# EAGLE design NSE2020_1 (EAGLE 9.4.2)
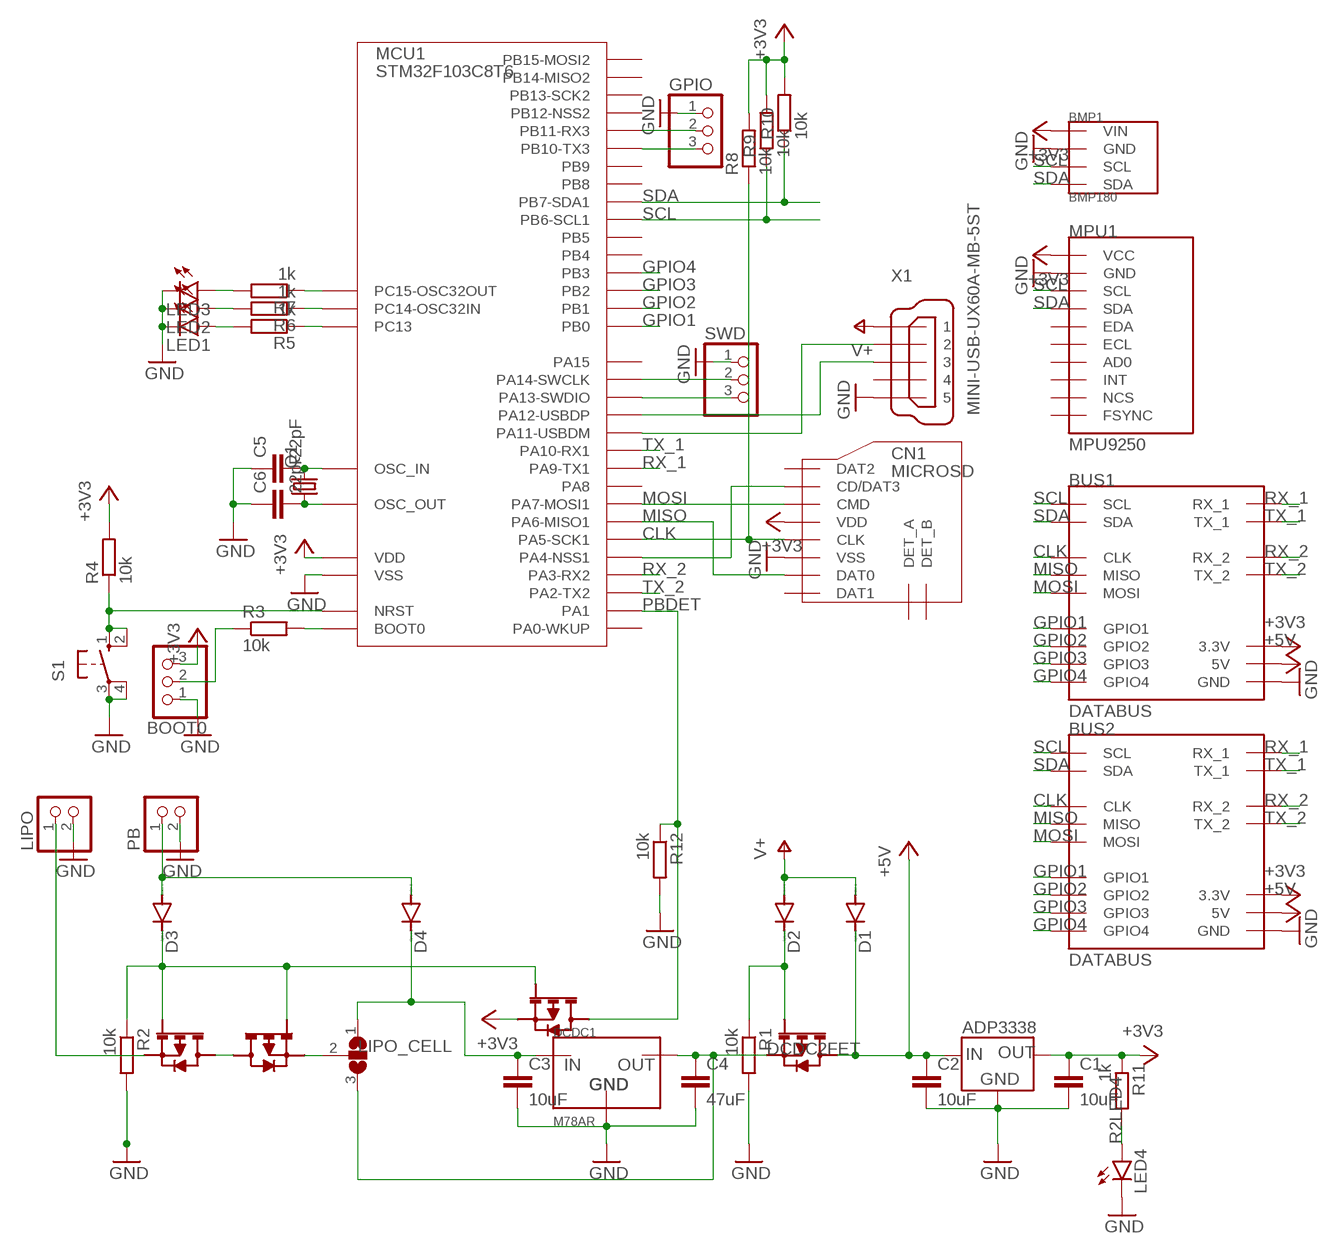
[diagram p0: schematic, sheet 1]

## Parts
BMP1  BMP180  [GY-68]
BOOT0  PINHD-1X3  [1X03]
BUS1  DATABUS  [8X2]
BUS2  DATABUS  [8X2]
C1  10uF  C-EUC2012  [C2012]
C2  10uF  C-EUC2012  [C2012]
C3  10uF  C-EUC2012  [C2012]
C4  47uF  C-EUC2012  [C2012]
C5  22pF  C-EUC2012  [C2012]
C6  22pF  C-EUC2012  [C2012]
CN1  MICROSD  [DM3AT]
D1  DIODE-SOD123  [SOD123]
D2  DIODE-SOD123  [SOD123]
D3  DIODE-SOD123  [SOD123]
D4  DIODE-SOD123  [SOD123]
DCDC1  M78AR  [M78AR]
GPIO  PINHD-1X3  [1X03]
IC1  ADP3338-3.3  [SOT-223]
LED1  LEDSMT1206  [1206]
LED2  LEDSMT1206  [1206]
LED3  LEDSMT1206  [1206]
LED4  LEDSMT1206  [1206]
LIPO  PINHD-1X2  [1X02]
LIPO_CELL  SJ2W  [SJ_2]
MCU1  STM32F103C8T6  [LQFP48]
MPU1  MPU9250  [GY-9250]
PB  PINHD-1X2  [1X02]
Q1  CRYSTALHC49S  [HC49/S]
R1  10k  R-EU_M2012  [M2012]
R2  10k  R-EU_M2012  [M2012]
R3  10k  R-EU_M2012  [M2012]
R4  10k  R-EU_M2012  [M2012]
R5  1k  R-EU_M2012  [M2012]
R6  1k  R-EU_M2012  [M2012]
R7  1k  R-EU_M2012  [M2012]
R8  10k  R-EU_M2012  [M2012]
R9  10k  R-EU_M2012  [M2012]
R10  10k  R-EU_M2012  [M2012]
R11  1k  R-EU_M2012  [M2012]
R12  10k  R-EU_M2012  [M2012]
S1  10-XX  [B3F-10XX]
SWD  PINHD-1X3  [1X03]
U$1  2SJ681  [2SJ681]
U$2  2SJ681  [2SJ681]
U$3  2SJ681  [2SJ681]
U$4  2SJ681  [2SJ681]
X1  MINI-USB-UX60A-MB-5ST  [UX60A-MB-5ST]

## Nets
+3V3 [PWR_L]: BMP1.P1(VIN) BOOT0.3 BUS1.P6(3.3V) BUS2.P6(3.3V) C1.1 CN1.VDD IC1.1(OUT) IC1.2(OUT) MCU1.1(VDD) MCU1.9(VDD) MCU1.24(VDD) MCU1.36(VDD) MCU1.48(VDD) MPU1.P1(VCC) R4.2 R8.2 R9.2 R10.2 R11.1 U$4.P$3
+5V [PWR_H]: BUS1.P7(5V) BUS2.P7(5V) C2.1 D1.C IC1.3(IN) U$1.P$2 U$1.P$4
BAT2DCDC [PWR_H]: C3.1 D4.C DCDC1.P1(IN) LIPO_CELL.1
BOOT0 [SIGNAL]: BOOT0.2 R3.1
BOOT0_R [SIGNAL]: MCU1.44(BOOT0) R3.2
CLK [SIGNAL]: BUS1.P1(CLK) BUS2.P1(CLK) CN1.CLK MCU1.15(PA5-SCK1) R8.1
CRYIN [IO]: C5.2 MCU1.5(OSC_IN) Q1.2
CRYOUT [IO]: C6.2 MCU1.6(OSC_OUT) Q1.1
CS_SD [SIGNAL]: CN1.CD/DAT3 MCU1.14(PA4-NSS1)
DCDC2FET [PWR_H]: C4.1 DCDC1.P3(OUT) LIPO_CELL.3 U$1.P$3
DM [SIGNAL]: MCU1.32(PA11-USBDM) X1.2
DP [SIGNAL]: MCU1.33(PA12-USBDP) X1.3
FET2JUMP [PWR_H]: LIPO_CELL.2 U$2.P$3
GND [GND]: BMP1.P2(GND) BOOT0.1 BUS1.P11(GND) BUS2.P11(GND) C1.2 C2.2 C3.2 C4.2 C5.1 C6.1 CN1.VSS DCDC1.P2(GND) GPIO.1 IC1.4(GND) LED1.C LED2.C LED3.C LED4.C LIPO.2 MCU1.8(VSS) MCU1.23(VSS) MCU1.35(VSS) MCU1.47(VSS) MPU1.P10(GND) PB.2 R1.2 R2.2 R12.2 S1.3(P) S1.4(P1) SWD.1 X1.5
GPIO1 [SIGNAL]: BUS1.P3(GPIO1) BUS2.P3(GPIO1) MCU1.18(PB0)
GPIO2 [SIGNAL]: BUS1.P10(GPIO2) BUS2.P10(GPIO2) MCU1.19(PB1)
GPIO3 [SIGNAL]: BUS1.P14(GPIO3) BUS2.P14(GPIO3) MCU1.20(PB2)
GPIO4 [SIGNAL]: BUS1.P15(GPIO4) BUS2.P15(GPIO4) MCU1.39(PB3)
IO2LED1 [IO]: MCU1.2(PC13) R5.1
IO2R2 [IO]: MCU1.3(PC14-OSC32IN) R6.1
IO2R3 [IO]: MCU1.4(PC15-OSC32OUT) R7.1
LIPO_FET2FET [PWR_H]: U$2.P$2 U$2.P$4 U$3.P$2 U$3.P$4
LIPOIN [PWR_H]: LIPO.1 U$3.P$3
MISO [SIGNAL]: BUS1.P12(MISO) BUS2.P12(MISO) CN1.DAT0 MCU1.16(PA6-MISO1)
MOSI [SIGNAL]: BUS1.P2(MOSI) BUS2.P2(MOSI) CN1.CMD MCU1.17(PA7-MOSI1)
NRST [SIGNAL]: MCU1.7(NRST) R4.1 S1.1(S) S1.2(S1)
PBDET [SIGNAL]: MCU1.11(PA1) R12.1 U$4.P$2 U$4.P$4
PBGATE [SIGNAL]: D3.C R2.1 U$2.P$1 U$3.P$1 U$4.P$1
PBIN [PWR_H]: D3.A D4.A PB.1
R2LED1 [IO]: LED1.A R5.2
R2LED2 [IO]: LED2.A R6.2
R2LED3 [IO]: LED3.A R7.2
R2LED4 [PWR_L]: LED4.A R11.2
RX_1 [SIGNAL]: BUS1.P4(RX_1) BUS2.P4(RX_1) MCU1.30(PA9-TX1)
RX_2 [SIGNAL]: BUS1.P9(RX_2) BUS2.P9(RX_2) MCU1.13(PA3-RX2)
RX_3 [IO]: GPIO.2 MCU1.22(PB11-RX3)
SCL [SIGNAL]: BMP1.P3(SCL) BUS1.P0(SCL) BUS2.P0(SCL) MCU1.42(PB6-SCL1) MPU1.P3(SCL) R9.1
SDA [SIGNAL]: BMP1.P4(SDA) BUS1.P13(SDA) BUS2.P13(SDA) MCU1.43(PB7-SDA1) MPU1.P4(SDA) R10.1
SWCLK [SIGNAL]: MCU1.37(PA14-SWCLK) SWD.2
SWDIO [SIGNAL]: MCU1.34(PA13-SWDIO) SWD.3
TX_1 [SIGNAL]: BUS1.P5(TX_1) BUS2.P5(TX_1) MCU1.31(PA10-RX1)
TX_2 [SIGNAL]: BUS1.P8(TX_2) BUS2.P8(TX_2) MCU1.12(PA2-TX2)
TX_3 [IO]: GPIO.3 MCU1.21(PB10-TX3)
USBGATE [SIGNAL]: D2.C R1.1 U$1.P$1
V+ [PWR_H]: D1.A D2.A X1.1
Unconnected: CN1.DAT1 CN1.DAT2 CN1.DET_A CN1.DET_B MCU1.10(PA0-WKUP) MCU1.25(PB12-NSS2) MCU1.26(PB13-SCK2) MCU1.27(PB14-MISO2) MCU1.28(PB15-MOSI2) MCU1.29(PA8) MCU1.38(PA15) MCU1.40(PB4) MCU1.41(PB5) MCU1.45(PB8) MCU1.46(PB9) MPU1.P2(AD0) MPU1.P5(ECL) MPU1.P6(EDA) MPU1.P7(FSYNC) MPU1.P8(INT) MPU1.P9(NCS) X1.4

## Library data of the parts
BMP1 = BMP180:BMP180
BOOT0 GPIO SWD = pinhead:PINHD-1X3: PIN HEADER
BUS1 BUS2 = databus:DATABUS
C1-C6 = rcl:C-EU: CAPACITOR, European symbol; SPICEPREFIX: C
CN1 = microSD:MICROSD
D1-D4 = diode:DIODE-: DIODE
DCDC1 = M78AR:M78AR
IC1 = ADP3338:ADP3338-3.3
LED1-LED4 = led:LED: LED OSRAM: - CHIPLED LG R971, LG N971, LY N971, LG Q971, LY Q971, LO R971, LY R971 LH N974, LH R974 LS Q976, LO Q976, LY Q976 LO Q996 - Hyper CHIPLED LW Q18S LB Q993, LB Q99A, LB R99A - SideLED LS A670, LO A670, LY A670, LG A670, LP A670 LB A673, LV A673, LT A673, LW A673 LH A674 LY A675 LS A676, LA A676, LO A676, LY A676, LW A676 LS A679, LY A679, LG A679 - Hyper Micro SIDELED® LS Y876, LA Y876, LO Y876, LY Y876 LT Y87S - SmartLED LW L88C, LW L88S LB L89C, LB L89S, LG L890 LS L89K, LO L89K, LY L89K LS L896, LA L896, LO L896, LY L896 - TOPLED LS T670, LO T670, LY T670, LG T670, LP T670 LSG T670, LSP T670, LSY T670, LOP T670, LYG T670 LG T671, LOG T671, LSG T671 LB T673, LV T673, LT T673, LW T673 LH T674 LS T676, LA T676, LO T676, LY T676, LB T676, LH T676, LSB T676, LW T676 LB T67C, LV T67C, LT T67C, LS T67K, LO T67K, LY T67K, LW E67C LS E67B, LA E67B, LO E67B, LY E67B, LB E67C, LV E67C, LT E67C LW T67C LS T679, LY T679, LG T679 LS T770, LO T770, LY T770, LG T770, LP T770 LB T773, LV T773, LT T773, LW T773 LH T774 LS E675, LA E675, LY E675, LS T675 LS T776, LA T776, LO T776, LY T776, LB T776 LHGB T686 LT T68C, LB T68C - Hyper Mini TOPLED® LB M676 - Mini TOPLED Santana® LG M470 LS M47K, LO M47K, LY M47K Source: http://www.osram.convergy.de LUXEON: - LUMILED® LXK2-PW12-R00, LXK2-PW12-S00, LXK2-PW14-U00, LXK2-PW14-V00 LXK2-PM12-R00, LXK2-PM12-S00, LXK2-PM14-U00 LXK2-PE12-Q00, LXK2-PE12-R00, LXK2-PE12-S00, LXK2-PE14-T00, LXK2-PE14-U00 LXK2-PB12-K00, LXK2-PB12-L00, LXK2-PB12-M00, LXK2-PB14-N00, LXK2-PB14-P00, LXK2-PB14-Q00 LXK2-PR12-L00, LXK2-PR12-M00, LXK2-PR14-Q00, LXK2-PR14-R00 LXK2-PD12-Q00, LXK2-PD12-R00, LXK2-PD12-S00 LXK2-PH12-R00, LXK2-PH12-S00 LXK2-PL12-P00, LXK2-PL12-Q00, LXK2-PL12-R00 Source: www.luxeon.com KINGBRIGHT: KA-3528ASYC Source: www.kingbright.com
LIPO PB = pinhead:PINHD-1X2: PIN HEADER
LIPO_CELL = jumper:SJ2W: SMD solder JUMPER
MCU1 = STM32F103C8T6:STM32F103C8T6
MPU1 = MPU9250:MPU9250
Q1 = crystal:CRYSTAL: CRYSTAL; OC_FARNELL: 1667008; OC_NEWARK: unknown
R1-R12 = rcl:R-EU_: RESISTOR, European symbol; SPICEPREFIX: R
S1 = switch-omron:10-XX: OMRON SWITCH; MPN: B3F-1000; OC_FARNELL: 176432; OC_NEWARK: 36M3542
U$1-U$4 = 2SJ681:2SJ681
X1 = con-hirose:MINI-USB-: MINI USB Connector Source: http://www.hirose.co.jp/cataloge_hp/e24000019.pdf; OC_FARNELL: unknown; OC_NEWARK: unknown

## Net classes
1 SIGNAL: width 0.152 mm, drill 0.305 mm, clearance 0.152 mm
2 PWR_H: width 0.635 mm, drill 0.305 mm, clearance 0.152 mm
3 PWR_L: width 0.381 mm, drill 0.305 mm, clearance 0.152 mm
4 GND: width 0.305 mm, drill 0.305 mm, clearance 0.152 mm
5 IO: width 0.305 mm, drill 0.305 mm, clearance 0.152 mm

## Board
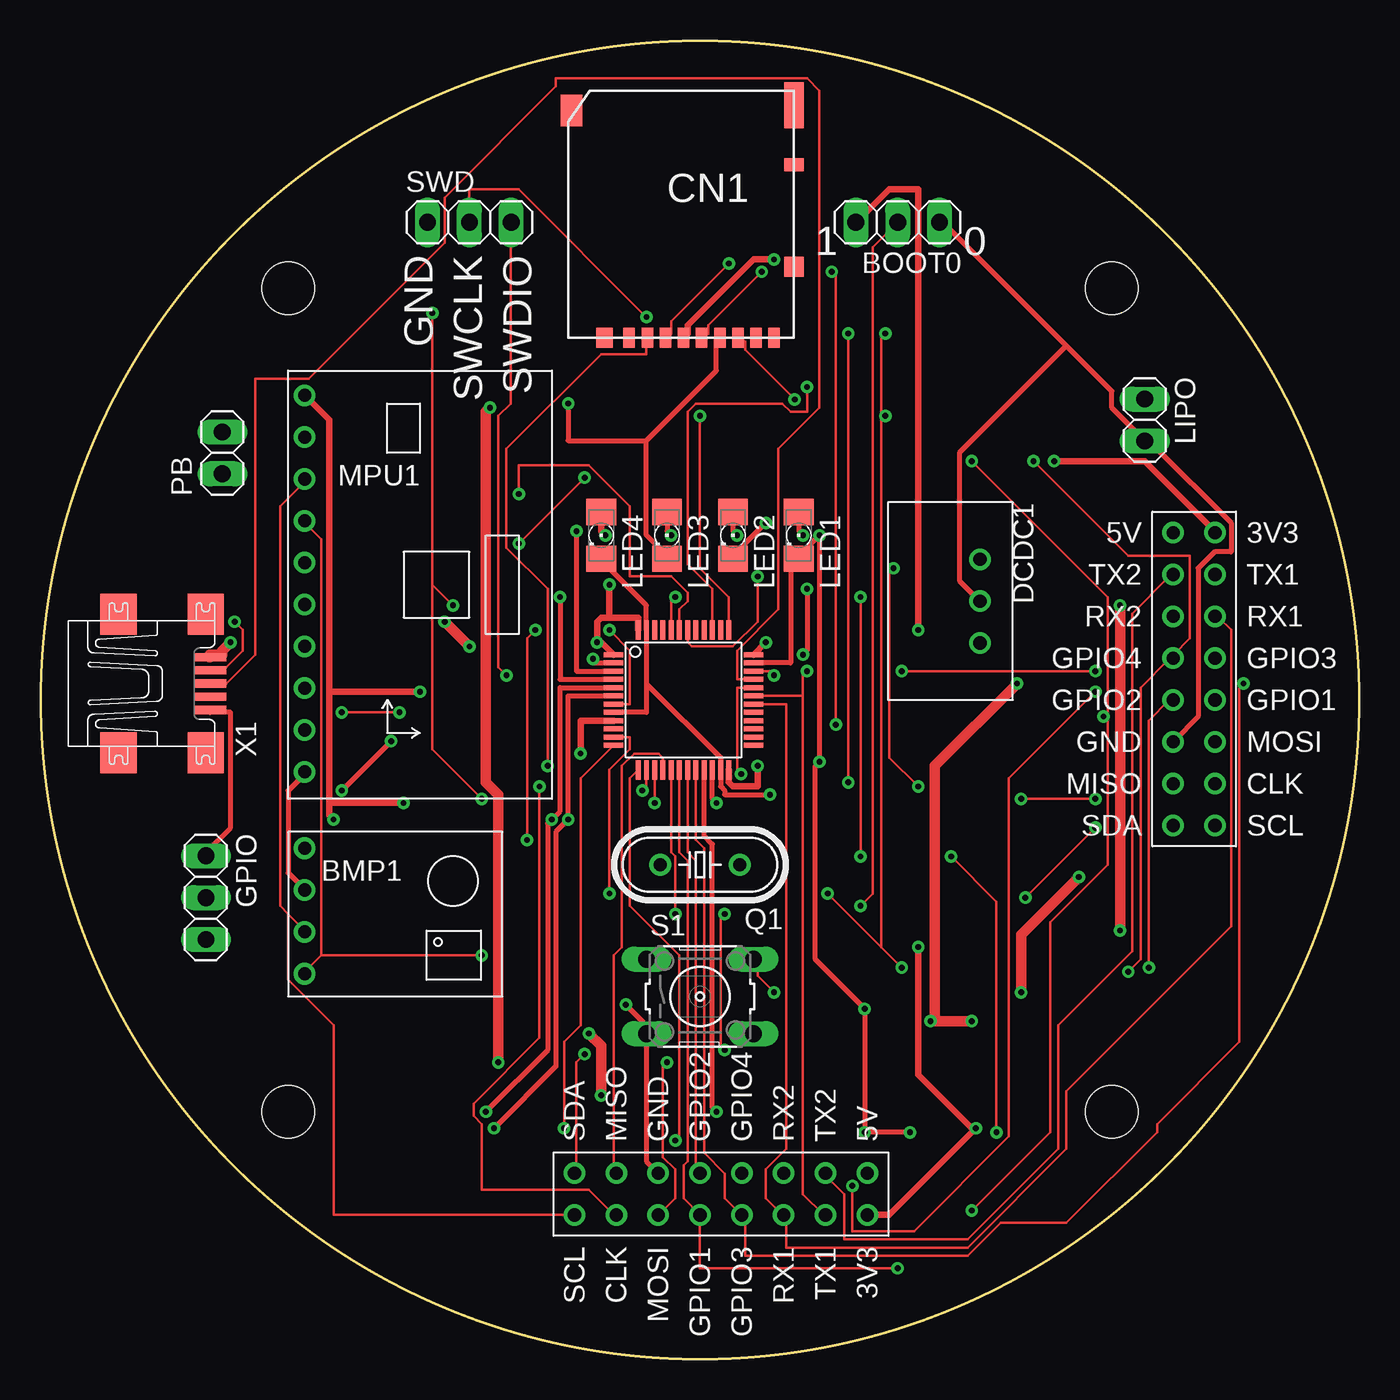
[diagram p1: board, top side]
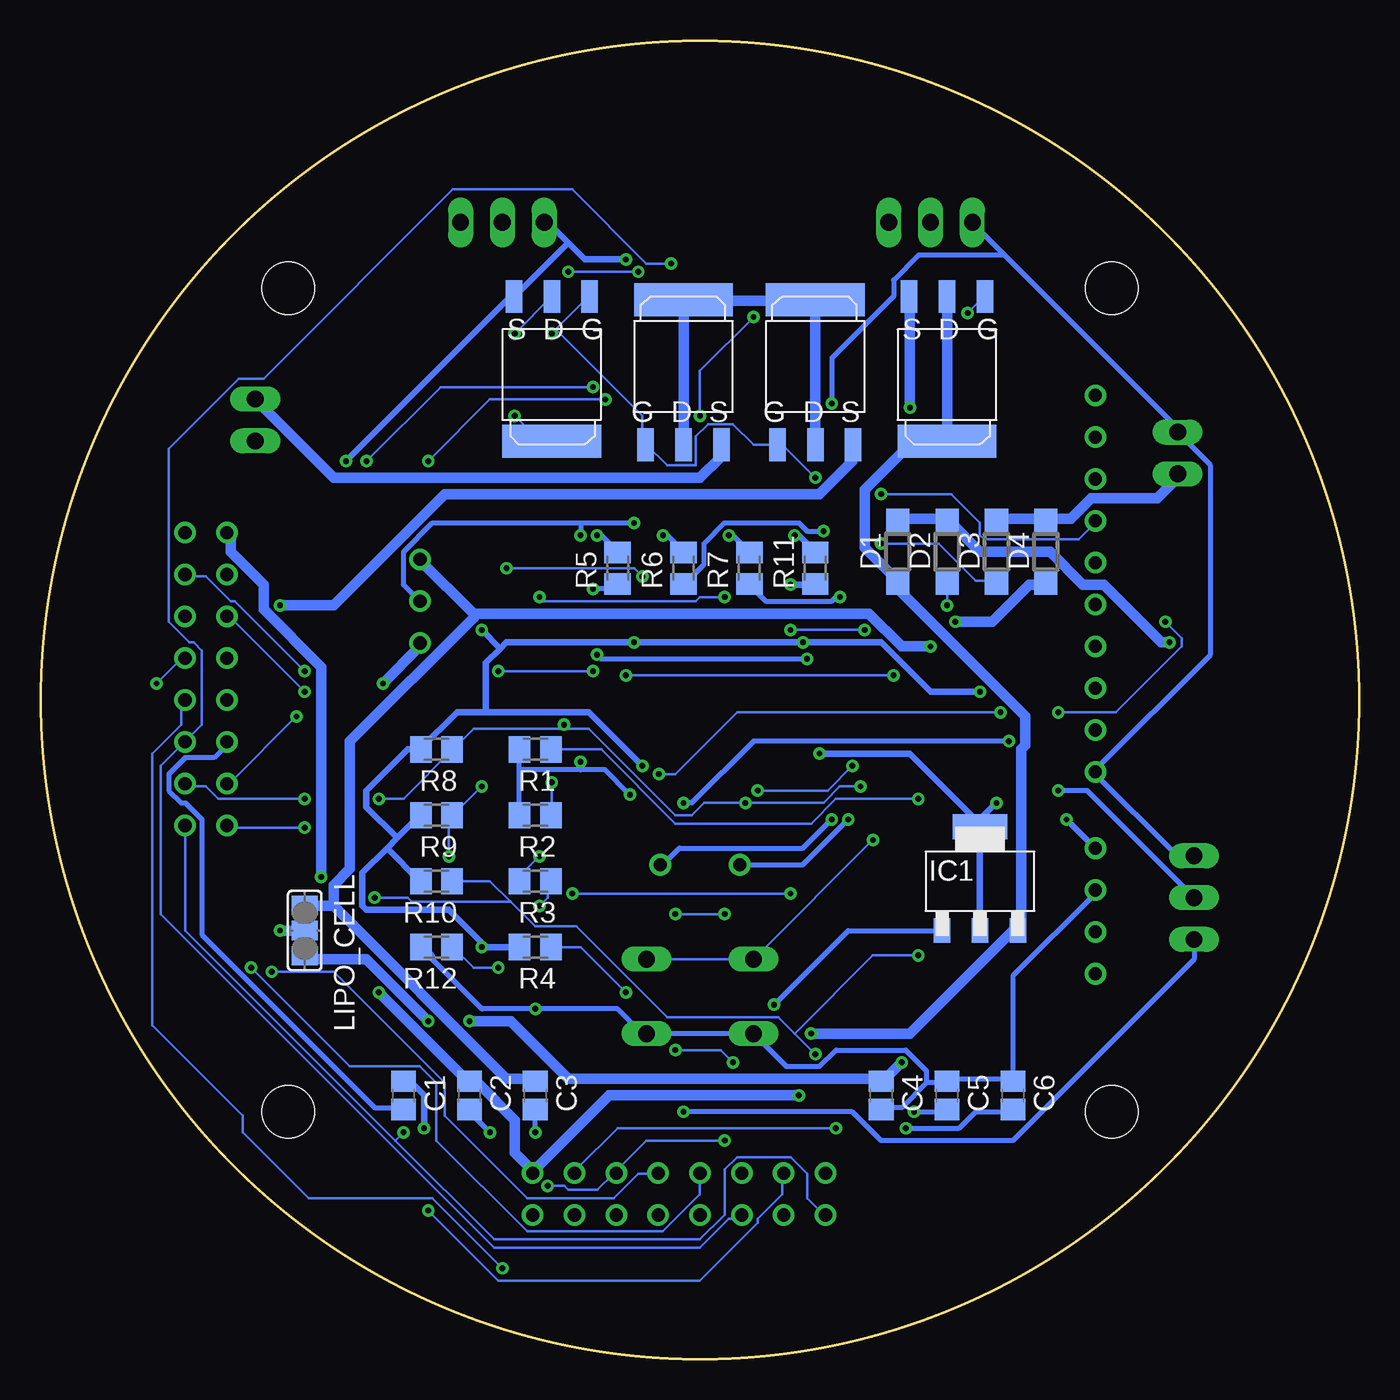
[diagram p2: board, bottom side, seen from below]

Size 80 x 80 mm. Coordinates in mm from the lower left corner, seen from the top.
Outline: circle at 40,40 radius 40
Copper layers (1*16): Top 0.035mm / dielectric 1.5mm / Bottom 0.035mm
Design rules "default": minimum track width 6mil, minimum drill 0.35mm, track to track 6mil, track to pad 6mil, pad to pad 6mil, via to via 6mil, smd to smd 6mil, copper to edge 40mil, drill to drill 6mil, minimum pad ring 10mil, minimum via ring 8mil, stop-mask expansion 4mil, vias tented up to drill 0mil, thermal gap 10mil
Holes 3.2 mm at 15,15 65,15 65,65 15,65
vRestrict: area 35,36 to 43,44

### Footprints (pad centres in the part's own frame; a part is rotated, then mirrored left to right if it is on the bottom)
GY-68 = drill 0.8: P1 -5,4; P2 -5,1.46; P3 -5,-1.08; P4 -5,-3.62
1X03 = drill 1.016 long: 1 -2.54,0; 2 0,0; 3 2.54,0
8X2 = drill 0.8: P0 -1.27,7.62; P1 -1.27,5.08; P2 -1.27,2.54; P3 -1.27,0; P4 -1.27,-5.08; P5 -1.27,-7.62; P6 -1.27,-10.16; P7 1.27,-10.16; P8 1.27,-7.62; P9 1.27,-5.08; P10 1.27,0; P11 1.27,2.54; P12 1.27,5.08; P13 1.27,7.62; P14 -1.27,-2.54; P15 1.27,-2.54
C2012 = smd 1.3 x 1.5: 1 -0.85,0; 2 0.85,0
DM3AT = smd 0.7 x 1.2: CD/DAT3 2.2,6; CLK -1.1,6; CMD 1.1,6; DAT0 -3.3,6; DAT1 -4.4,6; DAT2 3.3,6; DET_B -5.5,6; VDD 0,6; VSS -2.2,6 | smd 1.2 x 0.8: DET_A -6.7,-4.5 | smd 1 x 1.2: P$9 4.8,6 | smd 1.2 x 1.2: P$11 -6.7,1.7 | smd 1.2 x 2.8: P$13 -6.7,-8.1 | smd 1.3 x 1.9: P$14 6.8,-7.8
SOD123 = smd 1.4 x 1.4: A 1.9,0; C -1.9,0
M78AR = drill 0.8: P1 -2.54,0; P2 0,0; P3 2.54,0
SOT-223 = smd 3.3 x 1.5: 1 0,3.3 | smd 1 x 1.5: 2 0,-3; 3 2.3,-3; 4 -2.3,-3
1206 = smd 1.6 x 1.803: A -1.422,0; C 1.422,0
1X02 = drill 1.016 long: 1 -1.27,0; 2 1.27,0
SJ_2 = smd 1.168 x 1.6: 1 -1.524,0; 2 0,0; 3 1.524,0
LQFP48 = smd 0.3 x 1.2: 1 -2.75,-4.25; 2 -2.25,-4.25; 3 -1.75,-4.25; 4 -1.25,-4.25; 5 -0.75,-4.25; 6 -0.25,-4.25; 7 0.25,-4.25; 8 0.75,-4.25; 9 1.25,-4.25; 10 1.75,-4.25; 11 2.25,-4.25; 12 2.75,-4.25; 25 2.75,4.25; 26 2.25,4.25; 27 1.75,4.25; 28 1.25,4.25; 29 0.75,4.25; 30 0.25,4.25; 31 -0.25,4.25; 32 -0.75,4.25; 33 -1.25,4.25; 34 -1.75,4.25; 35 -2.25,4.25; 36 -2.75,4.25 | smd 1.2 x 0.3: 13 4.25,-2.75; 14 4.25,-2.25; 15 4.25,-1.75; 16 4.25,-1.25; 17 4.25,-0.75; 18 4.25,-0.25; 19 4.25,0.25; 20 4.25,0.75; 21 4.25,1.25; 22 4.25,1.75; 23 4.25,2.25; 24 4.25,2.75; 37 -4.25,2.75; 38 -4.25,2.25; 39 -4.25,1.75; 40 -4.25,1.25; 41 -4.25,0.75; 42 -4.25,0.25; 43 -4.25,-0.25; 44 -4.25,-0.75; 45 -4.25,-1.25; 46 -4.25,-1.75; 47 -4.25,-2.25; 48 -4.25,-2.75
GY-9250 = drill 0.8: P1 -7,11.5; P2 -7,8.96; P3 -7,6.42; P4 -7,3.88; P5 -7,1.34; P6 -7,-1.2; P7 -7,-3.74; P8 -7,-6.28; P9 -7,-8.82; P10 -7,-11.36
HC49/S = drill 0.813: 1 -2.413,0; 2 2.413,0
M2012 = smd 1.3 x 1.6: 1 -0.95,0; 2 0.95,0
B3F-10XX = drill 1.016 long: 1 -3.251,2.261; 2 3.251,2.261; 3 -3.251,-2.261; 4 3.251,-2.261
2SJ681 = smd 1 x 2: P$1 -2.3,-2.5; P$2 0,-2.5; P$3 2.3,-2.5 | smd 6 x 2: P$4 0,6.3
UX60A-MB-5ST = smd 2 x 0.5: 1 2.25,1.6; 2 2.25,0.8; 3 2.25,0; 4 2.25,-0.8; 5 2.25,-1.6 | smd 2.2 x 2.5: M1 -3.3,-4.2; M2 -3.3,4.2; M3 2,4.2; M4 2,-4.2

### Placement (x,y rotation side)
BMP1  21,27 0 top
BOOT0  52,69 180 top
BUS1  70,40 180 top
BUS2  40,10 90 top
C1  58,16 270 bottom
C2  54,16 270 bottom
C3  50,16 270 bottom
C4  29,16 270 bottom
C5  25,16 270 bottom
C6  21,16 270 bottom
CN1  39,68 180 top
D1  28,49 90 bottom
D2  25,49 90 bottom
D3  22,49 90 bottom
D4  19,49 90 bottom
DCDC1  57,46 270 top
GPIO  10,28 270 top
IC1  23,29 0 bottom
LED1  46,50 270 top
LED2  42,50 270 top
LED3  38,50 270 top
LED4  34,50 270 top
LIPO  67,57 270 top
LIPO_CELL  64,26 270 bottom
MCU1  39,40 270 top
MPU1  23,47 0 top
PB  11,55 90 top
Q1  40,30 180 top
R1  50,37 180 bottom
R2  50,33 180 bottom
R3  50,29 180 bottom
R4  50,25 180 bottom
R5  45,48 90 bottom
R6  41,48 90 bottom
R7  37,48 90 bottom
R8  56,37 180 bottom
R9  56,33 180 bottom
R10  56,29 180 bottom
R11  33,48 90 bottom
R12  56,25 180 bottom
S1  40,22 0 top
SWD  26,69 0 top
U$1  25,62 180 bottom
U$2  33,58 0 bottom
U$3  41,58 0 bottom
U$4  49,62 180 bottom
X1  8,41 0 top

### Tracks (layer width: path | path; a pad name or v marks a point on that pad's centre or on a via)
+3V3  (via drill 0.35)
  Top 0.381: CN1.VDD 39.25,62.25 39.25,62.75 43.25,66.75 v44.5,66.75 | v61.5,54.5 67,54.5 71.25,50.25 BUS1.P6 | MCU1.9 32.75,38.75 v32.75,36.75 | v17.75,32.75 17.5,33 17.5,33.75 | 17.5,40.5 17.5,57 MPU1.P1 | 17.5,40.5 17.5,33.75 | 17.5,33.75 v22,33.75 | BUS2.P6 50.25,8.75 51.5,8.75 v56.75,14 56.5,14 53.25,17.25 v53.25,25 | 33.88,43.62 33.75,43.75 33.75,44.75 34,45 34.5,45 | 33.88,43.62 MCU1.1 | 34.5,45 36.25,45 MCU1.48 | 34.5,45 v34.5,47 | MCU1.24 41.75,35 42,34.75 43.5,34.75 v43.5,36 | v44,43.5 MCU1.36 | v33.75,43.5 33.88,43.62 | v23,40.5 17.5,40.5 | v53.25,44.25 53.25,71 51.5,71 49.5,69 BOOT0.3
  Bottom 0.381: v44.5,66.75 47,66.75 48,67.75 | 48,67.75 49.25,69 BOOT0.3 | 48,67.75 51.25,64.5 U$4.P$3 51.5,64.5 v61.5,54.5 | v32.75,36.75 27.25,36.75 23,32.5 IC1.1 | IC1.1 IC1.2 | v17.75,32.75 BMP1.P1 | v22,33.75 23,32.75 IC1.1 | v56.75,14 56.75,16 57.5,16.75 58,16.75 C1.1 | R4.2 53,25 53.12,25.12 | 53.12,25.12 55.25,27.25 60.25,27.25 60.5,27.5 60.5,29.5 59,31 | 58.38,31.62 57,33 R9.2 | 58.38,31.62 59,31 | 59,31 57,29 R10.2 | v34.5,47 33,47 R11.1 | v43.5,36 46.75,39.25 53,39.25 | 53,39.25 54.75,39.25 57,37 | 52.12,43.12 53,42.25 53,39.25 | 52.12,43.12 51.75,43.5 v44,43.5 v33.75,43.5 29,43.5 26,40.5 v23,40.5 | 58.38,31.62 60.25,33.5 60.25,34.5 57.75,37 57,37 | 57,37 R8.2 | v53.25,25 53.12,25.12 | 52.12,43.12 v53.25,44.25
+5V  (via drill 0.35)
  Top 0.635: v63,29.25 59.5,25.75 v59.5,22.25 | v33.25,19.75 34,19 v34,16
  Bottom 0.635: U$1.P$2 U$1.P$4 25,55.5 27.25,55.5 30,52.75 30,49.25 28,47.25 D1.C 28.25,47 20.25,39 20.25,37.25 20.5,37 20.5,26 IC1.3 21,26 27.25,19.75 v33.25,19.75 | v63,29.25 63,42 66.5,45.5 66.5,47 68.5,49 68.5,50 BUS1.P7 | v59.5,22.25 54.25,17 C2.1 54,16.75 53.5,16.75 51.25,14.5 51.25,12.5 50.25,11.5 BUS2.P7 50,11.5 45.5,16 v34,16
BAT2DCDC  (via drill 0.35)
  Top 0.635: v26,43.25 v24.5,44.75
  Bottom 0.635: 62.25,27.5 51.75,17 50,17 C3.1 | 62.25,27.5 64,27.5 LIPO_CELL.1 | v24.5,44.75 22.25,44.75 20,47 19,47 D4.C | v26,43.25 27.75,43.25 29.75,45.25 53.75,45.25 | 53.75,45.25 57,48.5 DCDC1.P1 | 62.25,27.5 62.25,28.75 61.25,29.75 61.25,37.5 53.75,45 53.75,45.25
BOOT0  (via drill 0.35)
  Top 0.152: v49.75,27.5 50.5,28.25 50.5,67.5 BOOT0.2
  Bottom 0.152: v49.75,27.5 49.25,28 49.25,29 R3.1
BOOT0_R  (via drill 0.35)
  Top 0.152: MCU1.44 38.25,46 v38.5,46.25 | v49.75,30.5 v49.75,46.25
  Bottom 0.152: v38.5,46.25 40,46.25 40.25,46 49.5,46 v49.75,46.25 | v49.75,30.5 50.75,29.5 50.75,29 R3.2
CLK  (via drill 0.35)
  Top 0.152: v37.25,33.75 MCU1.15 | v43.75,66 40.5,62.75 40.5,62.25 40.25,62 CN1.CLK | v48,66 48.25,65.75 v48.25,38.5 | v30.25,34.75 30.25,19.5 26.25,15.5 26.25,14.75 26.75,14.25 26.75,10.25 33.25,10.25 34.75,8.75 BUS2.P1 | v59.5,34 v64,34
  Bottom 0.152: 48.25,38.25 53.75,38.25 55,37 | 48.25,38.25 46.75,38.25 41.5,33 40.5,33 39.75,33.75 v37.25,33.75 32.5,33.75 31.5,34.75 v30.25,34.75 | v48,66 v43.75,66 | 48.25,38.25 v48.25,38.5 | v64,34 69.25,34 70,34.75 71.25,34.75 BUS1.P1 | v59.5,34 58,34 55,37 | 55,37 R8.1
CRYIN  (via drill 0.35)
  Top 0.305: MCU1.5 31.5,40.75 31.5,33.25 v31,32.75 30.75,32.5 30.75,18.75 v27,15
  Bottom 0.305: v31,32.75 33.75,30 Q1.2 | v27,15 25,15 C5.2
CRYOUT  (via drill 0.35)
  Top 0.305: MCU1.6 32,40.25 v32,32.75 31.25,32 31.25,17.75 v27.5,14
  Bottom 0.305: v32,32.75 33.75,31 41.25,31 42.25,30 Q1.1 | v27.5,14 24.25,14 23.25,15 21,15 C6.2
CS_SD  (via drill 0.35)
  Top 0.152: MCU1.14 36.75,34.75 v36.5,34.5 | v30.75,36 30.75,46.75 28.25,49.25 28.25,55.25 34,61 36.75,61 36.75,62 CN1.CD/DAT3
  Bottom 0.152: v36.5,34.5 32.25,34.5 v30.75,36
DCDC2FET  (via drill 0.35)
  Top 0.635: v56.5,20.5 v54,20.5 54.25,20.75 54.25,36 v59.25,41 | v27.25,57.75 27,57.5 27,35 27.75,34.25 v27.75,18
  Bottom 0.635: v54,20.5 51.5,20.5 48,17 29,17 C4.1 28.75,17 v27.75,18 | v56.5,20.5 60.25,24.25 64,24.25 LIPO_CELL.3 | v27.25,57.75 27.25,64.5 U$1.P$3 | v59.25,41 57,43.25 DCDC1.P3
DM  (via drill 0.35)
  Top 0.152: MCU1.32 42.25,40.75 42.25,35.75 v42.5,35.5 | v18.25,39.25 v21.75,39.25 | v11.75,44.75 12.25,44.25 12.25,43 11.25,42 10.25,42 X1.2
  Bottom 0.152: v42.5,35.5 41.5,35.5 37.75,39.25 v21.75,39.25 | v18.25,39.25 14.75,39.25 10.75,43.25 10.75,43.75 v11.75,44.75
DP
  Top 0.152: MCU1.33 42.25,41.25 42.25,43 44.75,45.5 44.75,55.25 47.25,57.75 47.25,77 46.5,77.75 31.25,77.75 31.25,77.25 24.5,70.5 24.5,67.75 16.25,59.5 13,59.5 13,42.75 11.25,41 X1.3
FET2JUMP  (via drill 0.35)
  Top 0.635: v65.5,45.75 v65.5,26
  Bottom 0.635: v65.5,26 LIPO_CELL.2 | v65.5,45.75 62.25,45.75 55.5,52.5 32.75,52.5 30.75,54.5 30.75,55.5 U$2.P$3
GND  (via drill 0.35)
  Top 0.305: MCU1.8 36.75,39.25 36.75,41 | 36.75,41 MCU1.47 36.75,45.75 34,48.5 LED4.C | 36.75,41 41.25,36.5 MCU1.23 41.25,34.75 41.5,34.5 41.5,34.25 v44.25,34.25 | MCU1.35 45.5,42.25 45.5,48 46,48.5 LED1.C 46,48.75 v47.25,50 v47.25,36.25 47,36 47,24.25 v50,21.25 v50,13.75 v52.75,13.75 | v44,50.75 42,48.75 LED2.C | 62.25,61.5 65,58.75 65,57.75 67,55.75 LIPO.2 67,55.5 67.5,55.5 72.25,50.75 72.25,49 71.25,49 70.25,48 70.25,39 68.75,37.5 BUS1.P11 | 62.25,61.5 54.75,69 BOOT0.1 | DCDC1.P2 55.75,47.25 55.75,55 62.25,61.5 | 36.75,55.75 41,60 41,62 CN1.VSS | 36.75,55.75 36.75,50 38,48.75 LED3.C | 36.75,55.75 32,55.75 v32,58 | X1.5 10.25,39.25 11.5,39.25 11.5,32.25 10,30.75 GPIO.1 | BMP1.P2 16,28.5 15,29.5 15,34.5 16,35.5 MPU1.P10 | v35.5,21.5 36.5,20.5 36.5,19.75 S1.3 36.75,19.5 36.75,12 37.25,11.5 BUS2.P11
  Bottom 0.305: C1.2 58,15.25 59.75,15.25 70.25,25.75 70.25,32.75 71.25,33.75 71.5,33.75 72.25,34.5 72.25,35.5 71.25,36.5 69.5,36.5 68.75,37.25 BUS1.P11 | 51,35.75 51,37 R1.2 | 51,35.75 51,33 R2.2 | 47.25,35.75 45.75,35.75 v44.25,34.25 | 47.25,35.75 51,35.75 | 47.25,50.75 56.25,50.75 58,49 58,47 DCDC1.P2 | 47.25,50.75 v44,50.75 | 47.25,50.75 v47.25,50 | v47.25,36.25 47.25,35.75 | 21.5,67 23.5,69 SWD.1 | 21.5,67 11,56.5 PB.2 11,56.25 9,54.25 9,42.75 16,35.75 MPU1.P10 16,35.5 11.25,30.75 10,30.75 GPIO.1 | v32,58 32,60.75 28.25,64.5 28.25,65.5 26.75,67 21.5,67 | 21,17 25,17 C5.1 25,16.75 26.25,16.75 | 26.25,16.75 27.75,15.25 29,15.25 C4.2 | 21,17 21,23.25 16,28.25 BMP1.P2 | 21,17 C6.1 | v50,13.75 C3.2 | v52.75,13.75 54,15 C2.2 | R12.2 56.75,25 56.25,24.5 56.25,24.25 53.25,21.25 v50,21.25 45,21.25 43.5,19.75 S1.4 S1.3 36.5,19.5 34.75,17.75 32.75,17.75 31.75,18.75 27.5,18.75 26.25,17.5 26.25,16.75 | IC1.4 31,26 v35.5,21.5
GPIO1  (via drill 0.35)
  Top 0.152: MCU1.18 38.75,30.75 39.25,30.25 39.25,12 39,11.75 39,9.75 40,8.75 BUS2.P3 40,5.5 v52,5.5
  Bottom 0.152: v52,5.5 56.25,9.75 63.75,9.75 67.75,13.75 67.75,14.75 73.25,20.25 73.25,36.75 71.5,38.5 71.5,40 BUS1.P3
GPIO2  (via drill 0.35)
  Top 0.152: MCU1.19 39.25,30.75 39.75,30.25 39.75,11.75 40,11.5 BUS2.P10 | v67.25,23.75 67.25,38.75 68.5,40 BUS1.P10
  Bottom 0.152: v67.25,23.75 61.25,17.75 57,17.75 56,16.75 56,13.25 50.5,7.75 42.25,7.75 40,10 BUS2.P10
GPIO3  (via drill 0.35)
  Top 0.152: MCU1.20 39.75,31.5 40.25,31 40.25,12.5 41.5,11.25 41.5,9.75 42.5,8.75 BUS2.P14 42.75,8.5 42.75,6.25 56.25,6.25 58.25,8.25 62.25,8.25 67.75,13.75 67.75,14.25 72.75,19.25 72.75,40.75 v73,41
  Bottom 0.152: v73,41 71.5,42.5 BUS1.P14
GPIO4  (via drill 0.35)
  Top 0.152: MCU1.39 40.75,46.75 39.25,48.25 39.25,57.5 39.75,58 45,58 45.5,57.5 46.5,57.5 v46.5,59 | v60.25,54.5 66,48.75 69.75,48.75 69.75,43.75 68.75,42.75 BUS1.P15 68.5,42.5 66.75,40.75 66.75,24.25 v66,23.5
  Bottom 0.152: v46.5,59 55.75,59 v60.25,54.5 | v66,23.5 62.25,23.5 55.5,16.75 55.5,14.75 50.5,9.75 45.25,9.75 43.75,11.25 42.75,11.25 BUS2.P15
IO2LED1  (via drill 0.35)
  Top 0.305: MCU1.2 33.5,42.25 v33.5,42.5 | v46.25,42.75 46.5,43 v46.5,46.75
  Bottom 0.305: v33.5,42.5 46,42.5 v46.25,42.75 | v46.5,46.75 45.25,46.75 45,47 R5.1
IO2R2  (via drill 0.35)
  Top 0.305: MCU1.3 32.5,41.75 v32.5,50.25
  Bottom 0.305: v32.5,50.25 33.5,50.25 34,50.75 38.5,50.75 39.75,49.5 39.75,48.25 41,47 R6.1
IO2R3  (via drill 0.35)
  Top 0.305: MCU1.4 31.5,41.25 v31.5,46.25
  Bottom 0.305: v31.5,46.25 31.75,46.25 32,46 36,46 37,47 R7.1
LIPO_FET2FET
  Bottom 0.635: U$2.P$2 U$2.P$4 33.25,64.25 40.75,64.25 U$3.P$4 U$3.P$2
LIPOIN
  Bottom 0.635: U$3.P$3 38.75,55.5 38.75,54.75 40,53.5 62.25,53.5 67,58.25 LIPO.1
MISO  (via drill 0.35)
  Top 0.152: MCU1.16 37.75,36.5 37.5,36.75 36,36.75 35.25,36 35.25,25 34.75,24.5 34.75,11.5 BUS2.P12 | v45.75,58.25 42.75,61.25 42.75,61.75 42.5,62 CN1.DAT0 | v56.5,54.5 64.75,46.25 64.75,39.25 | v56.5,9 61.25,13.75 61.25,26.5 64.75,30 64.75,39.25 | 64.75,39.25 v64.5,39
  Bottom 0.152: v45.75,58.25 52.75,58.25 v56.5,54.5 | v64.5,39 68.5,35 BUS1.P12 | v56.5,9 52.25,4.75 40,4.75 36.5,8.25 36.5,8.5 35,10 35,11.25 BUS2.P12
MOSI  (via drill 0.35)
  Top 0.152: MCU1.17 38.25,30.75 38.5,30.5 v38.5,27 | v41.5,27 41.25,26.75 41.25,19 v41.5,18.75 | v38,18 37.75,17.75 37.75,12.25 38.5,11.5 38.5,9.75 37.5,8.75 BUS2.P2 | v41.75,66.5 38.25,63 38.25,62.25 38,62 CN1.CMD
  Bottom 0.152: v41.5,27 v38.5,27 | v41.5,18.75 38.75,18.75 v38,18 | v41.75,66.5 43.25,66.5 47.75,71 55,71 66.5,59.5 68,59.5 72.25,55.25 72.25,44.75 71,43.5 70.75,43.5 70.25,43 70.25,38.5 71.25,37.5 BUS1.P2 71.5,37.25 72.75,36 72.75,27 52.5,6.75 40,6.75 38.25,8.5 37.5,8.5 BUS2.P2
NRST  (via drill 0.35)
  Top 0.152: v44.5,22.25 43.5,23.25 43.5,24.25 S1.2 | MCU1.7 35.75,39.75 35.75,43 v34.5,44.25 | v30,44.25 29.5,43.75 v29.5,31.5
  Bottom 0.152: R4.1 47.25,25 v44.5,22.25 | v30,44.25 v34.5,44.25 | v29.5,31.5 36.5,24.5 S1.1 S1.2
PBDET  (via drill 0.35)
  Top 0.152: MCU1.11 35.75,37.75 35.75,37 34.5,35.75 v34.5,28.25 | v52.25,23.75 51,25 | 51,25 v47.75,28.25 | v51.25,62.25 51,62 51,57.25 | 51,25 51,57.25 | 51,57.25 v51.25,57.25
  Bottom 0.152: v47.75,28.25 v34.5,28.25 | v52.25,23.75 53.75,23.75 55,25 R12.1 | v51.25,62.25 U$4.P$2 | v51.25,57.25 49.75,55.75 49,55.75 U$4.P$4
PBGATE  (via drill 0.35)
  Top 0.152: v33,53.5 v29,49.5 | v49,62.25 v49,35
  Bottom 0.152: v29,49.5 25.5,49.5 23.25,47.25 22,47.25 D3.C | v33,53.5 35,55.5 U$2.P$1 36.75,55.5 38,56.75 39.5,56.75 40.25,56 40.25,54.25 42,54.25 43.25,55.5 U$3.P$1 43.5,55.5 43.5,57.25 48.75,62.5 | v49,35 49,33 R2.1 | 48.75,62.5 46.75,64.5 U$4.P$1 | 48.75,62.5 v49,62.25
PBIN
  Bottom 0.635: D3.A 22,51 19,51 D4.A 18.75,51 17.5,51 16.25,52.25 12.25,52.25 11,53.5 PB.1
R2LED1  (via drill 0.35)
  Top 0.305: v46.25,50 46,50.25 LED1.A
  Bottom 0.305: v46.25,50 46,50 45,49 R5.2
R2LED2  (via drill 0.35)
  Top 0.305: v42.25,50 42,50.25 LED2.A
  Bottom 0.305: v42.25,50 42,50 41,49 R6.2
R2LED3  (via drill 0.35)
  Top 0.305: v38.25,50 38,50.25 LED3.A
  Bottom 0.305: v38.25,50 38,50 37,49 R7.2
R2LED4  (via drill 0.35)
  Top 0.381: v34.25,50 34,50.25 LED4.A
  Bottom 0.381: v34.25,50 34,50 33,49 R11.2
RX_1
  Top 0.152: MCU1.30 45.25,39.75 45.25,12.75 44,11.5 44,9.75 45,8.75 BUS2.P4 45.25,8.5 45.25,6.75 56.25,6.75 62.25,12.75 62.25,16.25 72.25,26.25 72.25,44.25 71.5,45 BUS1.P4
RX_2  (via drill 0.35)
  Top 0.152: MCU1.13 35.75,35.25 35.75,27.5 38.75,24.5 38.75,13.5 v38.5,13.25 | v64,40.5 58.75,35.25 58.75,13.5 53,7.75 49.25,7.75 v49.25,10.5
  Bottom 0.152: v38.5,13.25 43.25,13.25 45,11.5 BUS2.P9 45.25,11.25 46.25,10.25 48,10.25 48.25,10.5 v49.25,10.5 | v64,40.5 68.5,45 BUS1.P9
RX_3  (via drill 0.35)
  Top 0.305: MCU1.22 40.75,34 v41,33.75 | v18.25,34.5 v21.25,37.5
  Bottom 0.305: v41,33.75 40.5,33.75 36.75,37.5 v21.25,37.5 | v18.25,34.5 16.5,34.5 GPIO.2
SCL  (via drill 0.35)
  Top 0.152: MCU1.42 39.25,43.5 39.5,43.25 42,43.25 43.5,44.75 v43.5,47.5 | v51.75,48 51.5,47.75 51.5,36.5 v53.25,34.75 | 15,27 14.5,27.5 14.5,51.75 16,53.25 MPU1.P3 | 15,27 16,26 BMP1.P3 | 15,27 15,23 17.75,20.25 17.75,8.75 32.25,8.75 BUS2.P0 | v55.25,30.5 58,27.75 v58,13.75
  Bottom 0.152: v43.5,47.5 44,48 v51.75,48 | v53.25,34.75 55,33 R9.1 55.25,33 v55.25,30.5 | 58.5,13.25 52.5,7.25 40,7.25 38.5,8.75 38.5,11.5 37.75,12.25 34.5,12.25 33.5,11.25 33.5,9.75 32.5,8.75 BUS2.P0 | 58.5,13.25 71.25,26 71.25,32.25 BUS1.P0 | 58.5,13.25 v58,13.75
SDA  (via drill 0.35)
  Top 0.152: MCU1.43 38.75,45.5 39.25,46 39.25,46.5 38.25,47.5 35.75,47.5 35.75,51.75 33.25,54.25 29,54.25 v29,52.5 | 17,24.5 16,23.5 BMP1.P4 | 17,24.5 17,49.75 16,50.75 MPU1.P4 | v33,18.5 32.5,18 32.5,11.5 BUS2.P13 | v59.75,28 v64,32.25 | v26.75,24.5 17,24.5
  Bottom 0.152: v29,52.5 24.75,52.5 23,50.75 23,50 22.75,49.75 17,49.75 16,50.75 MPU1.P4 | R10.1 52.75,29 51.5,27.75 | 51.5,27.75 50,26.25 47.5,26.25 42,20.75 35.25,20.75 34.25,19.75 | v33,18.5 34.25,19.75 | v64,32.25 68.5,32.25 BUS1.P13 | v59.75,28 57.75,28 57.5,27.75 51.5,27.75 | v26.75,24.5 29.5,24.5 34.25,19.75
SWCLK  (via drill 0.35)
  Top 0.152: MCU1.37 41.75,46.25 40,48 v40,57.25 | v36.75,63.25 29,71 26,71 SWD.2
  Bottom 0.152: v40,57.25 40,60 v36.75,63.25
SWDIO  (via drill 0.35)
  Top 0.152: MCU1.34 44.5,41.75 v44.5,41.5 | v28.25,41.5 27.75,42 27.75,57.25 28.5,58 28.5,69 SWD.3
  Bottom 0.152: v28.25,41.5 v44.5,41.5
TX_1  (via drill 0.35)
  Top 0.152: 46.25,40.25 MCU1.31 | 46.25,40.25 46.25,10 47.5,8.75 BUS2.P5 | v52.25,41.75 v64,41.75 | v46.5,41.75 46.25,41.5 46.25,40.25
  Bottom 0.152: v64,41.75 68.25,46 68.5,46 70,47.5 71.25,47.5 BUS1.P5 | v46.5,41.75 v52.25,41.75
TX_2  (via drill 0.35)
  Top 0.152: MCU1.12 32.75,35.25 32.75,20.25 31.75,19.25 v31.75,14 | BUS1.P8 68.5,47.5 66.25,45.25 66.25,24.75 61.75,20.25 61.75,12.75 56.25,7.25 48.75,7.25 48.75,10 47.75,11 47.75,11.25 BUS2.P8
  Bottom 0.152: v31.75,14 45,14 47.5,11.5 BUS2.P8
TX_3  (via drill 0.35)
  Top 0.305: MCU1.21 40.25,31.75 40.75,31.25 40.75,15.25 v41,15
  Bottom 0.305: v41,15 30.75,15 29,13.25 21,13.25 10,24.25 GPIO.3
USBGATE  (via drill 0.35)
  Top 0.152: 23.75,47 v25,45.75 | v23.75,63.5 23.75,47 | v26.75,34 23.75,37 23.75,47
  Bottom 0.152: v25,45.75 D2.C | v23.75,63.5 22.75,64.5 U$1.P$1 | R1.1 46,37 41.5,32.5 33.25,32.5 31.75,34 v26.75,34
V+  (via drill 0.35)
  Top 0.635: v11.5,43.5 11,43 11,42.75 10.25,42.75 X1.1
  Bottom 0.635: D1.A 28,51 25,51 D2.A 24.75,50.75 23,49 18.75,49 16.75,47 15.5,47 12,43.5 v11.5,43.5

### Text on the board
tNames: GND | SWCLK | SWDIO | 1 | 0